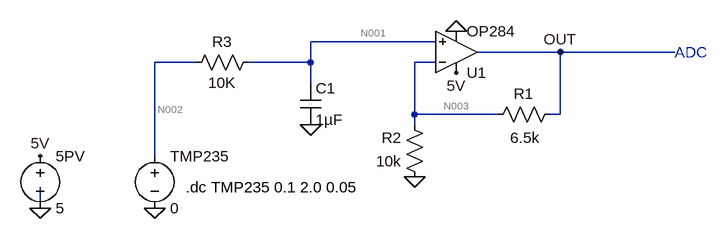
[diagram p0: schematic TMP235_Sim.asc]
TMP235_Sim.asc, the LTspice schematic file:
Version 4
SHEET 1 880 680
WIRE 336 -208 144 -208
WIRE 528 -192 400 -192
WIRE 704 -192 528 -192
WIRE -32 -176 -96 -176
WIRE 144 -176 144 -208
WIRE 144 -176 48 -176
WIRE 336 -176 304 -176
WIRE 144 -144 144 -176
WIRE 304 -96 304 -176
WIRE 432 -96 304 -96
WIRE 528 -96 528 -192
WIRE 528 -96 512 -96
WIRE 304 -80 304 -96
WIRE -96 -32 -96 -176
WIRE -272 48 -272 16
FLAG -272 48 0
FLAG -272 -32 5V
FLAG 368 -224 0
FLAG 368 -160 5V
FLAG 304 0 0
FLAG 528 -192 OUT
FLAG -96 48 0
FLAG 144 -80 0
SYMBOL voltage -96 -48 R0
SYMATTR InstName TMP235
SYMATTR Value 0
SYMBOL Opamps\\OP284 368 -128 M180
SYMATTR InstName U1
SYMBOL voltage -272 -48 R0
WINDOW 123 0 0 Left 0
WINDOW 39 0 0 Left 0
SYMATTR InstName 5PV
SYMATTR Value 5
SYMBOL res 528 -112 R90
WINDOW 0 0 56 VBottom 2
WINDOW 3 36 54 VTop 2
SYMATTR InstName R1
SYMATTR Value 6.5k
SYMBOL res 320 16 R180
WINDOW 0 36 76 Left 2
WINDOW 3 36 40 Left 2
SYMATTR InstName R2
SYMATTR Value 10k
SYMBOL res 64 -192 R90
WINDOW 0 0 56 VBottom 2
WINDOW 3 32 56 VTop 2
SYMATTR InstName R3
SYMATTR Value 10K
SYMBOL cap 128 -144 R0
SYMATTR InstName C1
SYMATTR Value 1µF
TEXT -48 16 Left 2 !.dc TMP235 0.1 2.0 0.05
TEXT 704 -192 Left 2 ;ADC

The netlist it stands for:
* TMP235_Sim.asc
V§TMP235 N002 0 0
XU1 N001 N003 5V 0 OUT OP284  ; pins In+ In- V+ V- OUT
V§5PV 5V 0 5
R1 OUT N003 6.5k
R2 0 N003 10k
R3 N001 N002 10K
C1 N001 0 1µF
.dc TMP235 0.1 2.0 0.05
* ADC
.lib ADI1.lib
.backanno
.end

* Results of the author's LTspice run, read from the files saved beside the schematic
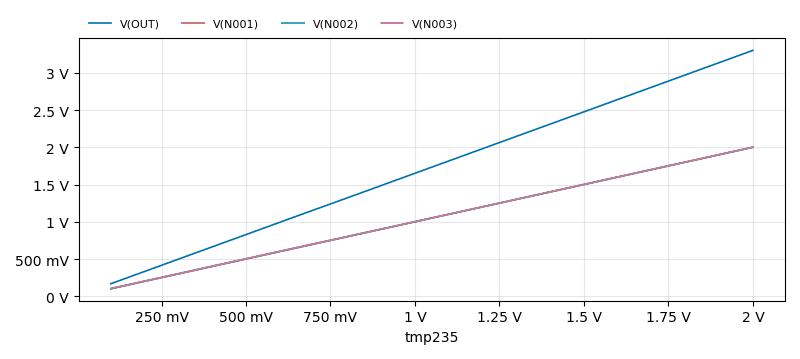
[diagram p1: DC transfer characteristic of TMP235_Sim.asc, plotted from the saved traces]
* DC transfer characteristic, 1 run:
*   V(OUT): 168 mV at tmp235=100 mV, 3.301 V at tmp235=2 V, min 168 mV, max 3.301 V
*   V(N001): 102.9 mV at tmp235=100 mV, 2.001 V at tmp235=2 V, min 102.9 mV, max 2.001 V
*   V(N002): 100 mV at tmp235=100 mV, 2 V at tmp235=2 V, min 100 mV, max 2 V
*   V(N003): 102.9 mV at tmp235=100 mV, 2.001 V at tmp235=2 V, min 102.9 mV, max 2.001 V